# Altium schematic sheet snesio.SchDoc
size A4
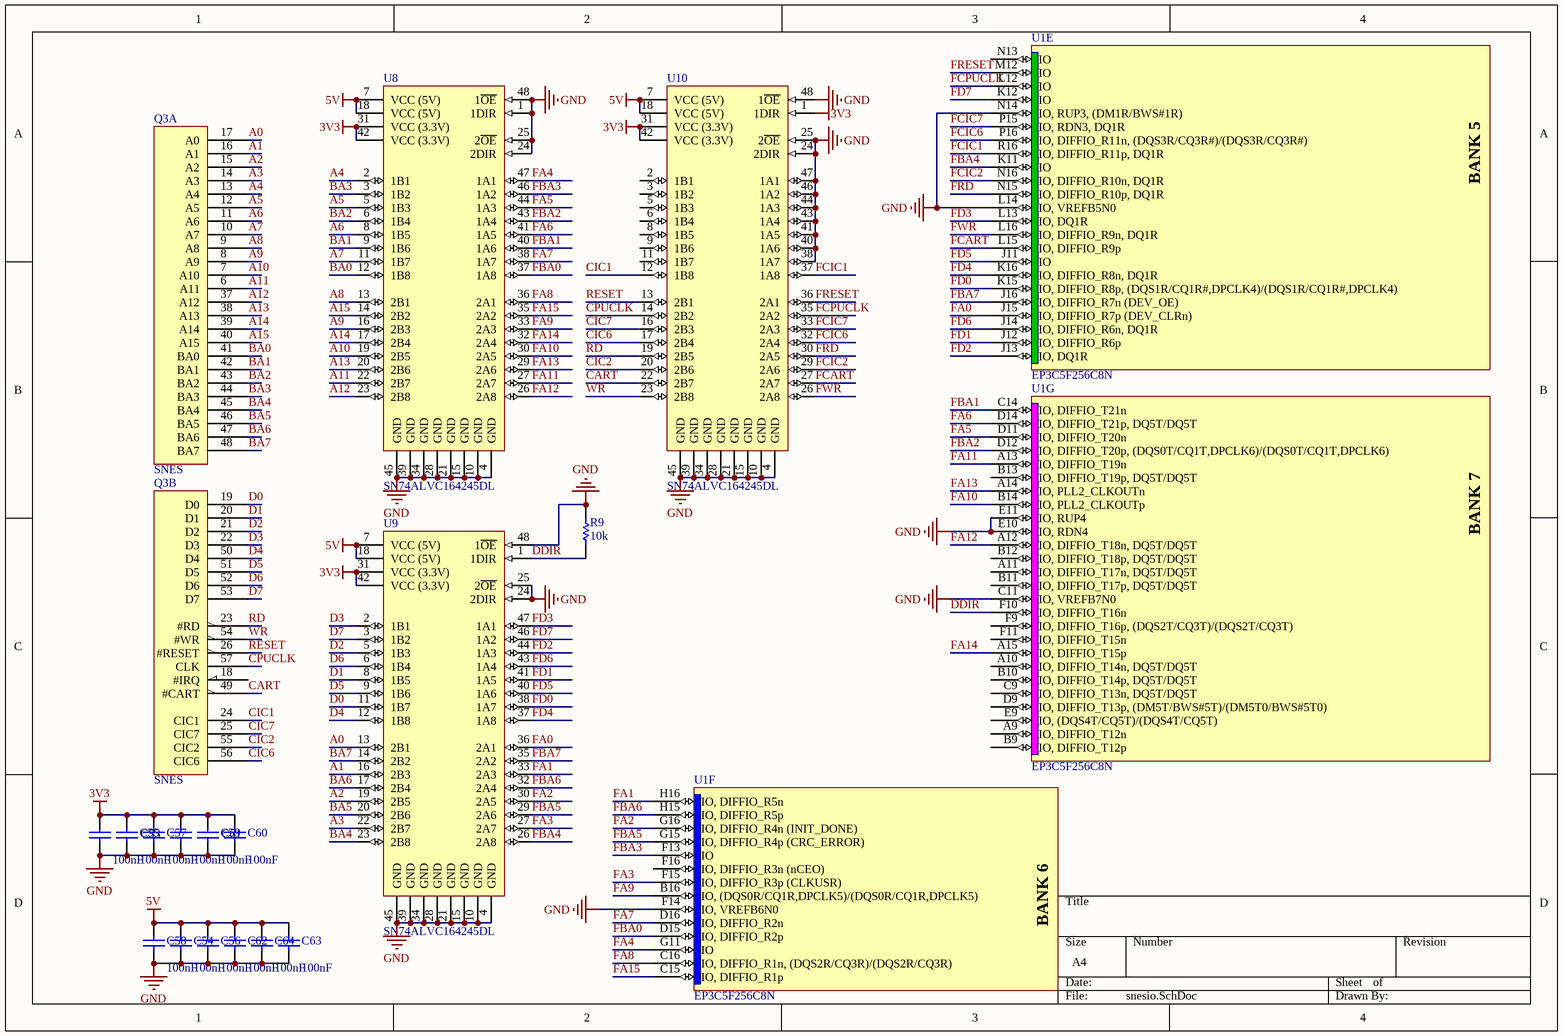
[diagram p0: snesio.SchDoc]

## Parts
C53  value 100nF  [CAPC1005X06L]
C54  value 100nF  [CAPC1005X06L]
C55  value 100nF  [CAPC1005X06L]
C56  value 100nF  [CAPC1005X06L]
C57  value 100nF  [CAPC1005X06L]
C58  value 100nF  [CAPC1005X06L]
C59  value 100nF  [CAPC1005X06L]
C60  value 100nF  [CAPC1005X06L]
C61  value 100nF  [CAPC1005X06L]
C62  value 100nF  [CAPC1005X06L]
C63  value 100nF  [CAPC1005X06L]
C64  value 100nF  [CAPC1005X06L]
Q3  SNES  [SNES]  (parts A,B of 3)
R9  value 10k  [RESC2012X70N]  (hidden comment: Res1)
U1  EP3C5F256C8N  [FBGA256-2]  (parts E,F,G of 13)
U8  SN74ALVC164245DL  [DL048]
U9  SN74ALVC164245DL  [DL048]
U10  SN74ALVC164245DL  [DL048]

## Nets
3V3: C53.2 C55.2 C57.2 C59.2 C60.2 C61.2 U8.31(VCC_(3.3V)) U8.42(VCC_(3.3V)) U9.31(VCC_(3.3V)) U9.42(VCC_(3.3V)) U10.1(1DIR) U10.31(VCC_(3.3V)) U10.42(VCC_(3.3V))
5V: C54.2 C56.2 C58.2 C62.2 C63.2 C64.2 U8.7(VCC_(5V)) U8.18(VCC_(5V)) U9.7(VCC_(5V)) U9.18(VCC_(5V)) U10.7(VCC_(5V)) U10.18(VCC_(5V))
GND: C53.1 C54.1 C55.1 C56.1 C57.1 C58.1 C59.1 C60.1 C61.1 C62.1 C63.1 C64.1 R9.1 U1.C11(IO,_VREFB7N0) U1.E10(IO,_RDN4) U1.E11(IO,_RUP4) U1.F14(IO,_VREFB6N0) U1.L14(IO,_VREFB5N0) U1.N14(IO,_RUP3,_(DM1R/BWS#1R)) U8.1(1DIR) U8.4(GND) U8.10(GND) U8.15(GND) U8.21(GND) U8.24(2DIR) U8.25(2~{OE}) U8.28(GND) U8.34(GND) U8.39(GND) U8.45(GND) U8.48(1~{OE}) U9.4(GND) U9.10(GND) U9.15(GND) U9.21(GND) U9.24(2DIR) U9.25(2~{OE}) U9.28(GND) U9.34(GND) U9.39(GND) U9.45(GND) U9.48(1~{OE}) U10.4(GND) U10.10(GND) U10.15(GND) U10.21(GND) U10.24(2DIR) U10.25(2~{OE}) U10.28(GND) U10.34(GND) U10.38(1A7) U10.39(GND) U10.40(1A6) U10.41(1A5) U10.43(1A4) U10.44(1A3) U10.45(GND) U10.46(1A2) U10.47(1A1) U10.48(1~{OE})
A0: Q3.17(A0) U9.13(2B1)
A1: Q3.16(A1) U9.16(2B3)
A2: Q3.15(A2) U9.19(2B5)
A3: Q3.14(A3) U9.22(2B7)
A4: Q3.13(A4) U8.2(1B1)
A5: Q3.12(A5) U8.5(1B3)
A6: Q3.11(A6) U8.8(1B5)
A7: Q3.10(A7) U8.11(1B7)
A8: Q3.9(A8) U8.13(2B1)
A9: Q3.8(A9) U8.16(2B3)
A10: Q3.7(A10) U8.19(2B5)
A11: Q3.6(A11) U8.22(2B7)
A12: Q3.37(A12) U8.23(2B8)
A13: Q3.38(A13) U8.20(2B6)
A14: Q3.39(A14) U8.17(2B4)
A15: Q3.40(A15) U8.14(2B2)
BA0: Q3.41(BA0) U8.12(1B8)
BA1: Q3.42(BA1) U8.9(1B6)
BA2: Q3.43(BA2) U8.6(1B4)
BA3: Q3.44(BA3) U8.3(1B2)
BA4: Q3.45(BA4) U9.23(2B8)
BA5: Q3.46(BA5) U9.20(2B6)
BA6: Q3.47(BA6) U9.17(2B4)
BA7: Q3.48(BA7) U9.14(2B2)
CART: Q3.49(#CART) U10.22(2B7)
CIC1: Q3.24(CIC1) U10.12(1B8)
CIC2: Q3.55(CIC2) U10.20(2B6)
CIC6: Q3.56(CIC6) U10.17(2B4)
CIC7: Q3.25(CIC7) U10.16(2B3)
CPUCLK: Q3.57(CLK) U10.14(2B2)
D0: Q3.19(D0) U9.11(1B7)
D1: Q3.20(D1) U9.8(1B5)
D2: Q3.21(D2) U9.5(1B3)
D3: Q3.22(D3) U9.2(1B1)
D4: Q3.50(D4) U9.12(1B8)
D5: Q3.51(D5) U9.9(1B6)
D6: Q3.52(D6) U9.6(1B4)
D7: Q3.53(D7) U9.3(1B2)
DDIR: R9.2 U1.F10(IO,_DIFFIO_T16n) U9.1(1DIR)
FA0: U1.J15(IO,_DIFFIO_R7p_(DEV_CLRn)) U9.36(2A1)
FA1: U1.H16(IO,_DIFFIO_R5n) U9.33(2A3)
FA2: U1.G16(IO,_DIFFIO_R4n_(INIT_DONE)) U9.30(2A5)
FA3: U1.F15(IO,_DIFFIO_R3p_(CLKUSR)) U9.27(2A7)
FA4: U1.G11(IO) U8.47(1A1)
FA5: U1.D11(IO,_DIFFIO_T20n) U8.44(1A3)
FA6: U1.D14(IO,_DIFFIO_T21p,_DQ5T/DQ5T) U8.41(1A5)
FA7: U1.D16(IO,_DIFFIO_R2n) U8.38(1A7)
FA8: U1.C16(IO,_DIFFIO_R1n,_(DQS2R/CQ3R)/(DQS2R/CQ3R)) U8.36(2A1)
FA9: U1.B16(IO,_(DQS0R/CQ1R,DPCLK5)/(DQS0R/CQ1R,DPCLK5)) U8.33(2A3)
FA10: U1.B14(IO,_PLL2_CLKOUTp) U8.30(2A5)
FA11: U1.A13(IO,_DIFFIO_T19n) U8.27(2A7)
FA12: U1.A12(IO,_DIFFIO_T18n,_DQ5T/DQ5T) U8.26(2A8)
FA13: U1.A14(IO,_PLL2_CLKOUTn) U8.29(2A6)
FA14: U1.A15(IO,_DIFFIO_T15p) U8.32(2A4)
FA15: U1.C15(IO,_DIFFIO_R1p) U8.35(2A2)
FBA0: U1.D15(IO,_DIFFIO_R2p) U8.37(1A8)
FBA1: U1.C14(IO,_DIFFIO_T21n) U8.40(1A6)
FBA2: U1.D12(IO,_DIFFIO_T20p,_(DQS0T/CQ1T,DPCLK6)/(DQS0T/CQ1T,DPCLK6)) U8.43(1A4)
FBA3: U1.F13(IO) U8.46(1A2)
FBA4: U1.K11(IO) U9.26(2A8)
FBA5: U1.G15(IO,_DIFFIO_R4p_(CRC_ERROR)) U9.29(2A6)
FBA6: U1.H15(IO,_DIFFIO_R5p) U9.32(2A4)
FBA7: U1.J16(IO,_DIFFIO_R7n_(DEV_OE)) U9.35(2A2)
FCART: U1.L15(IO,_DIFFIO_R9p) U10.27(2A7)
FCIC1: U1.R16(IO,_DIFFIO_R11p,_DQ1R) U10.37(1A8)
FCIC2: U1.N16(IO,_DIFFIO_R10n,_DQ1R) U10.29(2A6)
FCIC6: U1.P16(IO,_DIFFIO_R11n,_(DQS3R/CQ3R#)/(DQS3R/CQ3R#)) U10.32(2A4)
FCIC7: U1.P15(IO,_RDN3,_DQ1R) U10.33(2A3)
FCPUCLK: U1.L12(IO) U10.35(2A2)
FD0: U1.K15(IO,_DIFFIO_R8p,_(DQS1R/CQ1R#,DPCLK4)/(DQS1R/CQ1R#,DPCLK4)) U9.38(1A7)
FD1: U1.J12(IO,_DIFFIO_R6p) U9.41(1A5)
FD2: U1.J13(IO,_DQ1R) U9.44(1A3)
FD3: U1.L13(IO,_DQ1R) U9.47(1A1)
FD4: U1.K16(IO,_DIFFIO_R8n,_DQ1R) U9.37(1A8)
FD5: U1.J11(IO) U9.40(1A6)
FD6: U1.J14(IO,_DIFFIO_R6n,_DQ1R) U9.43(1A4)
FD7: U1.K12(IO) U9.46(1A2)
FRD: U1.N15(IO,_DIFFIO_R10p,_DQ1R) U10.30(2A5)
FRESET: U1.M12(IO) U10.36(2A1)
FWR: U1.L16(IO,_DIFFIO_R9n,_DQ1R) U10.26(2A8)
RD: Q3.23(#RD) U10.19(2B5)
RESET: Q3.26(#RESET) U10.13(2B1)
WR: Q3.54(#WR) U10.23(2B8)

Not connected (* = marked no-connect by the designer): Q3 18(#IRQ); U1 A9(IO,_DIFFIO_T12n) A10(IO,_DIFFIO_T14n,_DQ5T/DQ5T) A11(IO,_DIFFIO_T17n,_DQ5T/DQ5T) B9(IO,_DIFFIO_T12p) B10(IO,_DIFFIO_T14p,_DQ5T/DQ5T) B11(IO,_DIFFIO_T17p,_DQ5T/DQ5T) B12(IO,_DIFFIO_T18p,_DQ5T/DQ5T) B13(IO,_DIFFIO_T19p,_DQ5T/DQ5T) C9(IO,_DIFFIO_T13n,_DQ5T/DQ5T) D9(IO,_DIFFIO_T13p,_(DM5T/BWS#5T)/(DM5T0/BWS#5T0)) E9(IO,_(DQS4T/CQ5T)/(DQS4T/CQ5T)) F9(IO,_DIFFIO_T16p,_(DQS2T/CQ3T)/(DQS2T/CQ3T)) F11(IO,_DIFFIO_T15n) F16(IO,_DIFFIO_R3n_(nCEO)) N13(IO); U10 2(1B1) 3(1B2) 5(1B3) 6(1B4) 8(1B5) 9(1B6) 11(1B7)

## Notes on the sheet
- (in symbol EP3C5F256C8N, part E) BANK 5
- (in symbol EP3C5F256C8N, part F) BANK 6
- (in symbol EP3C5F256C8N, part G) BANK 7

## Library data of the parts
C53-C64 = Cap: Capacitor; Published: 8-Jun-2000; LatestRevisionDate: 17-Jul-2002; LatestRevisionNote: Re-released for DXP Platform.; PackageReference: RAD-0.3; Publisher: Altium Limited; PackageDescription: Radial Cap, Thru-Hole; 2 Leads; 0.3 in Pin Spacing
R9 = Res1: Resistor; Published: 8-Jun-2000; LatestRevisionDate: 17-Jul-2002; LatestRevisionNote: Re-released for DXP Platform.; PackageReference: AXIAL-0.3; Publisher: Altium Limited; PackageDescription: Axial Device, Thru-Hole; 2 Leads; 0.3 in Pin Spacing
U1 = EP3C5F256C8N: Cyclone III Family FPGA, 182 I/O Pins, 4 PLLs, 256-Pin FBGA, Speed Grade 8, Commercial Grade, Pb-Free; Published: 14-Mar-2008; DatasheetVersion: ver2.0, May-2008; PackageVersion: ver16.0, Dec-2009; PackageReference: FBGA256-2; Publisher: Altium Limited; PackageDescription: 256-Ball FineLine Ball Grid Array (FBGA256) - Option 2 - Wire Bond; Supplier 1: Digi-Key; Supplier Part Number 1: 544-2423-ND; Supplier 2: Farnell; Supplier Part Number 2: 1549367; Supplier 3: Farnell; Supplier Part Number 3: 1662274; Code_JEDEC: MO-192-DAF-1; ComponentLink1Description: Manufacturer Link; ComponentLink1URL: http://www.altera.com/; ComponentLink2Description: Handbook (7.86MB); ComponentLink2URL: http://www.altera.com/literature/hb/cyc3/cyclone3_handbook.pdf; ComponentLink3Description: Packaging Specification; ComponentLink3URL: http://www.altera.com/literature/ds/dspkg.pdf
U8-U10 = SN74ALVC164245DL: 16-Bit 3.3-V to 5-V Level Shifting Transceiver with 3-State Outputs; Published: 8-Jun-2000; LatestRevisionDate: 04-Mar-2005; LatestRevisionNote: Stylized 3D Model Added.; DatasheetVersion: Feb-1999; PackageVersion: Dec-2001; PackageReference: DL048; Publisher: Altium Limited; PackageDescription: SSOP; 48 Leads; Body Width 7.5 mm; Pitch 0.635 mm; Code_JEDEC: MO-118-AA; Code_IPC: SSO48; ComponentLink1Description: Manufacturer Link; ComponentLink1URL: http://www.ti.com/; ComponentLink2Description: Datasheet; ComponentLink2URL: http://www-s.ti.com/sc/ds/sn74alvc164245.pdf